# Altium schematic sheet not.SchDoc: NOT Gate
size 209 x 148 mm; Revision: 1.0.0; SheetNumber: 6; SheetTotal: 10
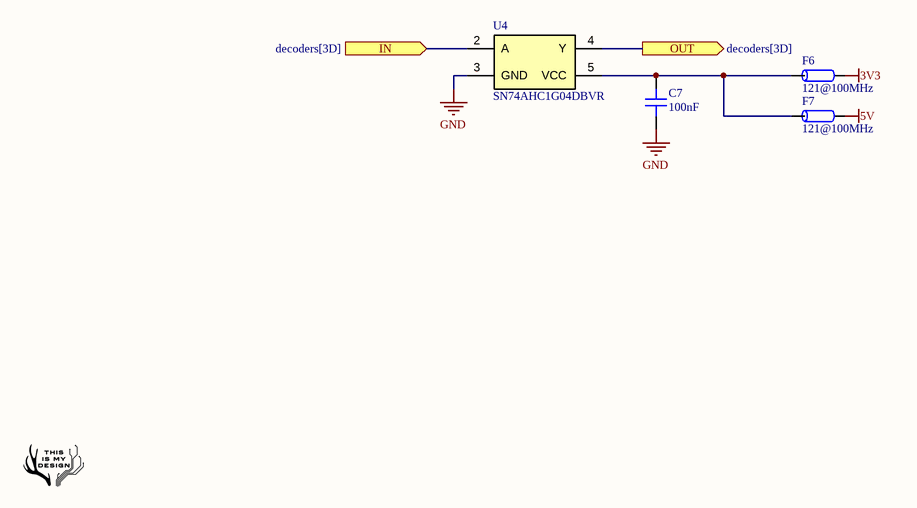
[diagram p0: not.SchDoc]

## Parts
C7  100nF  [CAP 0603_1608]
F6  121@100MHz  [Ferrite-0805]
F7  121@100MHz  [Ferrite-0805]
U4  SN74AHC1G04DBVR  [SOT23-5L]

## Ports
IN (in, see decoders[3D]), OUT (out, see decoders[3D])

## Nets
3V3: F6.1
5V: F7.1
GND: C7.1 U4.3(GND)
IN: U4.2(A) ; port IN
OUT: U4.4(Y) ; port OUT
NetC7_2: C7.2 F6.2 F7.2 U4.5(VCC)

## Notes on the sheet
- TITLE
- DESIGNER
- PRODUCT NUMBER
- SHEET VERSION
- SHEET
- OF
- LAST MODIFIED

## Library data of the parts
C7 = Cap 0603: SMT Capacitor; VALUE: 100nF
F6 F7 = Ferrite Bead
U4 = SN74AHC1G04: Single input NOT gate